# Altium project XMC4800-Dev.PrjPcb
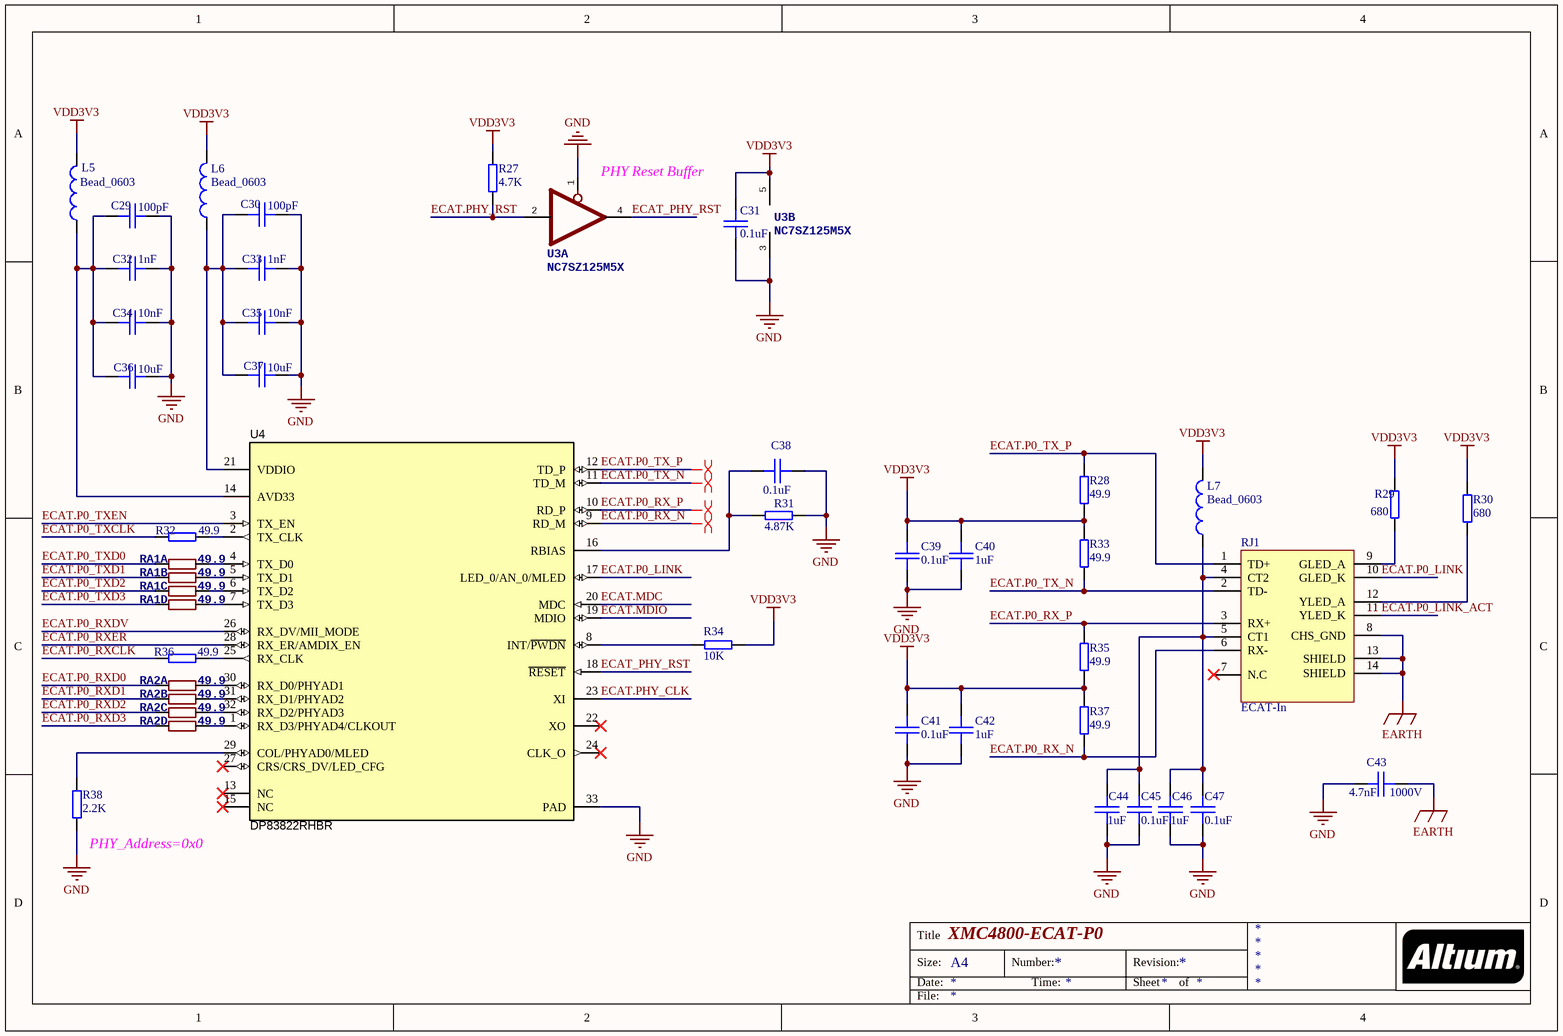
[diagram p0: XMC4800-ECAT-P0.SchDoc]
5 sheets, 160 parts. Net scope: global (net labels, ports and power ports of the same name join across sheets).
Board file: XMC4800-Dev.PcbDoc
Sheets:
  XMC4800-ECAT-P0.SchDoc
  XMC4800-ECAT-P1.SchDoc
  XMC4800-Core.SchDoc
  XMC4800-Power.SchDoc
  XMC4800-Misc.SchDoc

## Sheet XMC4800-ECAT-P0.SchDoc: XMC4800-ECAT-P0
size A4

### Parts
C29  100pF  [CAP-0603]
C30  100pF  [CAP-0603]
C31  0.1uF  [CAP-0603]
C32  1nF  [CAP-0603]
C33  1nF  [CAP-0603]
C34  10nF  [CAP-0603]
C35  10nF  [CAP-0603]
C36  10uF  [CAP-0603]
C37  10uF  [CAP-0603]
C38  0.1uF  [CAP-0603]
C39  0.1uF  [CAP-0603]
C40  1uF  [CAP-0603]
C41  0.1uF  [CAP-0603]
C42  1uF  [CAP-0603]
C43  4.7nF  voltage: 1000V  [CAP-1206]
C44  1uF  [CAP-0603]
C45  0.1uF  [CAP-0603]
C46  1uF  [CAP-0603]
C47  0.1uF  [CAP-0603]
L5  Bead_0603  [L-0603]
L6  Bead_0603  [L-0603]
L7  Bead_0603  [L-0603]
R27  4.7K  [RES-0603]
R28  49.9  [RES-0603]
R29  680  [RES-0603]
R30  680  [RES-0603]
R31  4.87K  [RES-0603]
R32  49.9  [RES-0603]
R33  49.9  [RES-0603]
R34  10K  [RES-0603]
R35  49.9  [RES-0603]
R36  49.9  [RES-0603]
R37  49.9  [RES-0603]
R38  2.2K  [RES-0603]
RA1  49.9  [LC-0603_Rx4]  (parts A,B,C,D of 4)
RA2  49.9  [LC-0603_Rx4]  (parts A,B,C,D of 4)
RJ1  ECAT-In  [HR911105A]
U3  NC7SZ125M5X  [LC-SOT-23-5]  (parts A,B of 2)
U4  DP83822RHBR  [RHB0032B]

### Nets
EARTH: C43.2 RJ1.8(CHS_GND) RJ1.13(SHIELD) RJ1.14(SHIELD)
GND: C29.2 C30.2 C31.2 C32.1 C33.1 C34.1 C35.1 C36.1 C37.1 C38.2 C39.2 C40.2 C41.2 C42.2 C43.1 C44.2 C45.2 C46.2 C47.2 R31.2 R38.1 U3.1(OE) U3.3(GND) U4.33(PAD)
VDD3V3: C31.1 C39.1 C40.1 C41.1 C42.1 L5.2 L6.2 L7.2 R27.2 R28.1 R29.2 R30.1 R33.2 R34.2 R35.1 R37.2 U3.5(VDD)
ECAT.MDC: U4.20(MDC)
ECAT.MDIO: U4.19(MDIO)
ECAT.P0_LINK: RJ1.10(GLED_K) U4.17(LED_0/AN_0/MLED)
ECAT.P0_LINK_ACT: RJ1.11(YLED_K)
ECAT.P0_RX_N: R37.1 RJ1.6(RX-) U4.9(RD_M)
ECAT.P0_RX_P: R35.2 RJ1.3(RX+) U4.10(RD_P)
ECAT.P0_RXCLK: R36.1
ECAT.P0_RXD0: RA2.1
ECAT.P0_RXD1: RA2.2
ECAT.P0_RXD2: RA2.3
ECAT.P0_RXD3: RA2.4
ECAT.P0_RXDV: U4.26(RX_DV/MII_MODE)
ECAT.P0_RXER: U4.28(RX_ER/AMDIX_EN)
ECAT.P0_TX_N: R33.1 RJ1.2(TD-) U4.11(TD_M)
ECAT.P0_TX_P: R28.2 RJ1.1(TD+) U4.12(TD_P)
ECAT.P0_TXCLK: R32.1
ECAT.P0_TXD0: RA1.1
ECAT.P0_TXD1: RA1.2
ECAT.P0_TXD2: RA1.3
ECAT.P0_TXD3: RA1.4
ECAT.P0_TXEN: U4.3(TX_EN)
ECAT.PHY_CLK: U4.23(XI)
ECAT.PHY_RST: R27.1 U3.2(I)
ECAT_PHY_RST: U3.4(O) U4.18(~{RESET})
NetC29_1: C29.1 C32.2 C34.2 C36.2 L5.1 U4.14(AVD33)
NetC30_1: C30.1 C33.2 C35.2 C37.2 L6.1 U4.21(VDDIO)
NetC38_1: C38.1 R31.1 U4.16(RBIAS)
NetC44_1: C44.1 C45.1 C46.1 C47.1 L7.1 RJ1.4(CT2) RJ1.5(CT1)
NetR29_1: R29.1 RJ1.9(GLED_A)
NetR30_2: R30.2 RJ1.12(YLED_A)
NetR32_2: R32.2 U4.2(TX_CLK)
NetR34_1: R34.1 U4.8(INT/~{PWDN})
NetR36_2: R36.2 U4.25(RX_CLK)
NetR38_2: R38.2 U4.29(COL/PHYAD0/MLED)
NetRA1_5: RA1.5 U4.7(TX_D3)
NetRA1_6: RA1.6 U4.6(TX_D2)
NetRA1_7: RA1.7 U4.5(TX_D1)
NetRA1_8: RA1.8 U4.4(TX_D0)
NetRA2_5: RA2.5 U4.1(RX_D3/PHYAD4/CLKOUT)
NetRA2_6: RA2.6 U4.32(RX_D2/PHYAD3)
NetRA2_7: RA2.7 U4.31(RX_D1/PHYAD2)
NetRA2_8: RA2.8 U4.30(RX_D0/PHYAD1)

Not connected (* = marked no-connect by the designer): RJ1 7(N.C)*; U4 13(NC)* 15(NC)* 22(XO)* 24(CLK_O)* 27(CRS/CRS_DV/LED_CFG)*

### Layout directives
differential pair: ECAT.P0_RX_N, ECAT.P0_RX_P, ECAT.P0_TX_N, ECAT.P0_TX_P

### Notes on the sheet
- (near U3) PHY Reset Buffer
- (near R38) PHY_Address=0x0
- Title
- Size:
- Date:
- A4
- Number:
- Time:
- Revision:
- Sheet
- of
- File:

### Library data of the parts
C29-C42 C44-C47 = C_0603: 陶瓷贴片电容0603; tolerance: 10%; voltage: 50V; ESR: 1.73mOhm; IRMS: 5.59A; Series: X7R
  C29 C30: C_value: 100pF
  C31 C38 C39 C41 C45 C47: C_value: 0.1uF
  C32 C33: C_value: 1nF
  C34 C35: C_value: 10nF
  C36 C37: C_value: 10uF
  C40 C42 C44 C46: C_value: 1uF
C43 = C_1206: 陶瓷贴片电容1206; tolerance: 10%; C_value: 4.7nF
L5-L7 = Bead_0603: 贴片磁珠0603; Impedance: 120Ohm; Current: 2A
R27-R38 = R_0603: 贴片电阻0603; tolerance: 5%; voltage: 50V; power: 0.063W
  R27: R_value: 4.7K
  R28 R32 R33 R35-R37: R_value: 49.9
  R29 R30: R_value: 680
  R31: R_value: 4.87K
  R34: R_value: 10K
  R38: R_value: 2.2K
RA1 RA2 = RS_ARR4: 排阻; R_Value: 49.9
RJ1 = HR911105A: Input; LatestRevisionDate: 17-Jul-2002; LatestRevisionNote: Re-released for DXP Platform.; Publisher: Altium Limited
U3 = NC7SZ125M5X: 单通道缓冲器，3态输出
U4 = DP83822RHBR: 10/100 Ethernet PHY, RHB0032B; Alternate PartNumber: DP83822RHBT; Manufacturer: Texas Instruments; SymbolCreator: Altium; SizeArea_mm2: 25; SizeAreaWB_mm2: 49; SizeX_mm: 5; SizeZ_mm: 1; CompType: IC; U/M: EA; SymbolVersion: 2016-3-6; PartNumber: DP83822RHBR; PackageReference: RHB0032B; PackageDescription: VQFN-32; MountType: SMT; SizeY_mm: 5; ComponentLink1Description: Datasheet Link; ComponentLink1URL: https://sps06.itg.ti.com/sites/KMS/crossdivteams/altium/docs/ComponentDatasheets/DP83822 Hardware Requirements.docx; RoHS: Y; Publisher: Texas Instruments; LatestRevisionDate: 2016-07-20; Alternate Manufacturer: Texas Instruments

## Sheet XMC4800-ECAT-P1.SchDoc: XMC4800-ECAT-P1
size A4
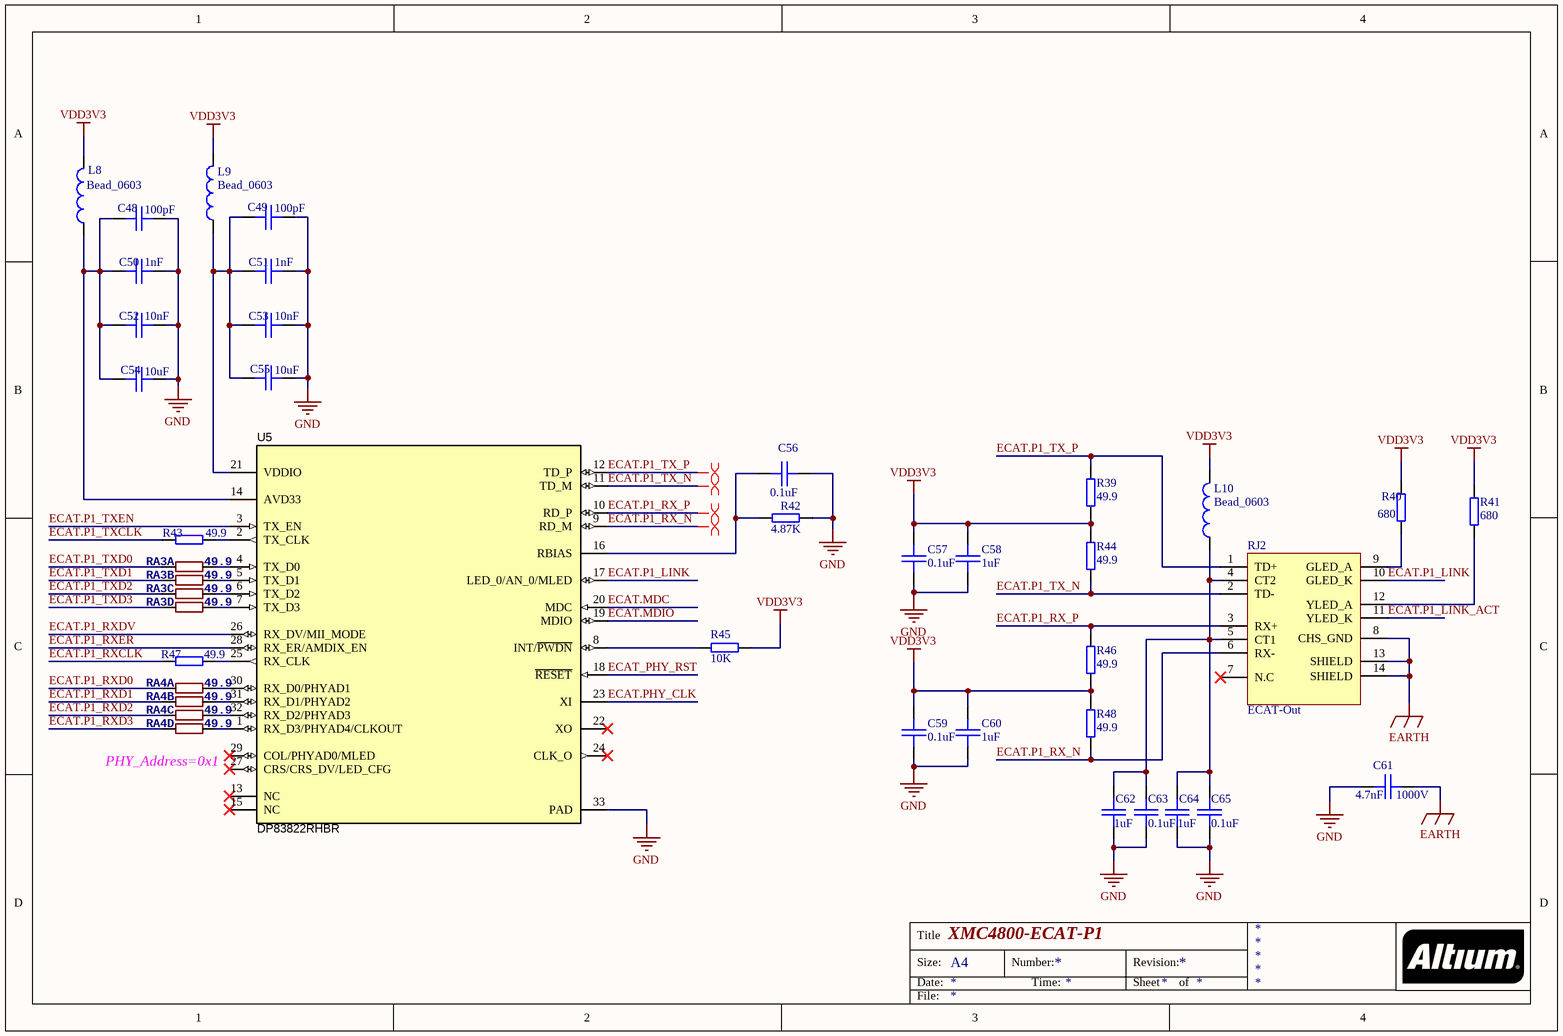
[diagram p1: XMC4800-ECAT-P1.SchDoc]

### Parts
C48  100pF  [CAP-0603]
C49  100pF  [CAP-0603]
C50  1nF  [CAP-0603]
C51  1nF  [CAP-0603]
C52  10nF  [CAP-0603]
C53  10nF  [CAP-0603]
C54  10uF  [CAP-0603]
C55  10uF  [CAP-0603]
C56  0.1uF  [CAP-0603]
C57  0.1uF  [CAP-0603]
C58  1uF  [CAP-0603]
C59  0.1uF  [CAP-0603]
C60  1uF  [CAP-0603]
C61  4.7nF  voltage: 1000V  [CAP-1206]
C62  1uF  [CAP-0603]
C63  0.1uF  [CAP-0603]
C64  1uF  [CAP-0603]
C65  0.1uF  [CAP-0603]
L8  Bead_0603  [L-0603]
L9  Bead_0603  [L-0603]
L10  Bead_0603  [L-0603]
R39  49.9  [RES-0603]
R40  680  [RES-0603]
R41  680  [RES-0603]
R42  4.87K  [RES-0603]
R43  49.9  [RES-0603]
R44  49.9  [RES-0603]
R45  10K  [RES-0603]
R46  49.9  [RES-0603]
R47  49.9  [RES-0603]
R48  49.9  [RES-0603]
RA3  49.9  [LC-0603_Rx4]  (parts A,B,C,D of 4)
RA4  49.9  [LC-0603_Rx4]  (parts A,B,C,D of 4)
RJ2  ECAT-Out  [HR911105A]
U5  DP83822RHBR  [RHB0032B]

### Nets
EARTH: C61.2 RJ2.8(CHS_GND) RJ2.13(SHIELD) RJ2.14(SHIELD)
GND: C48.2 C49.2 C50.1 C51.1 C52.1 C53.1 C54.1 C55.1 C56.2 C57.2 C58.2 C59.2 C60.2 C61.1 C62.2 C63.2 C64.2 C65.2 R42.2 U5.33(PAD)
VDD3V3: C57.1 C58.1 C59.1 C60.1 L8.2 L9.2 L10.2 R39.1 R40.2 R41.1 R44.2 R45.2 R46.1 R48.2
ECAT.MDC: U5.20(MDC)
ECAT.MDIO: U5.19(MDIO)
ECAT.P1_LINK: RJ2.10(GLED_K) U5.17(LED_0/AN_0/MLED)
ECAT.P1_LINK_ACT: RJ2.11(YLED_K)
ECAT.P1_RX_N: R48.1 RJ2.6(RX-) U5.9(RD_M)
ECAT.P1_RX_P: R46.2 RJ2.3(RX+) U5.10(RD_P)
ECAT.P1_RXCLK: R47.1
ECAT.P1_RXD0: RA4.1
ECAT.P1_RXD1: RA4.2
ECAT.P1_RXD2: RA4.3
ECAT.P1_RXD3: RA4.4
ECAT.P1_RXDV: U5.26(RX_DV/MII_MODE)
ECAT.P1_RXER: U5.28(RX_ER/AMDIX_EN)
ECAT.P1_TX_N: R44.1 RJ2.2(TD-) U5.11(TD_M)
ECAT.P1_TX_P: R39.2 RJ2.1(TD+) U5.12(TD_P)
ECAT.P1_TXCLK: R43.1
ECAT.P1_TXD0: RA3.1
ECAT.P1_TXD1: RA3.2
ECAT.P1_TXD2: RA3.3
ECAT.P1_TXD3: RA3.4
ECAT.P1_TXEN: U5.3(TX_EN)
ECAT.PHY_CLK: U5.23(XI)
ECAT_PHY_RST: U5.18(~{RESET})
NetC48_1: C48.1 C50.2 C52.2 C54.2 L8.1 U5.14(AVD33)
NetC49_1: C49.1 C51.2 C53.2 C55.2 L9.1 U5.21(VDDIO)
NetC56_1: C56.1 R42.1 U5.16(RBIAS)
NetC62_1: C62.1 C63.1 C64.1 C65.1 L10.1 RJ2.4(CT2) RJ2.5(CT1)
NetR40_1: R40.1 RJ2.9(GLED_A)
NetR41_2: R41.2 RJ2.12(YLED_A)
NetR43_2: R43.2 U5.2(TX_CLK)
NetR45_1: R45.1 U5.8(INT/~{PWDN})
NetR47_2: R47.2 U5.25(RX_CLK)
NetRA3_5: RA3.5 U5.7(TX_D3)
NetRA3_6: RA3.6 U5.6(TX_D2)
NetRA3_7: RA3.7 U5.5(TX_D1)
NetRA3_8: RA3.8 U5.4(TX_D0)
NetRA4_5: RA4.5 U5.1(RX_D3/PHYAD4/CLKOUT)
NetRA4_6: RA4.6 U5.32(RX_D2/PHYAD3)
NetRA4_7: RA4.7 U5.31(RX_D1/PHYAD2)
NetRA4_8: RA4.8 U5.30(RX_D0/PHYAD1)

Not connected (* = marked no-connect by the designer): RJ2 7(N.C)*; U5 13(NC)* 15(NC)* 22(XO)* 24(CLK_O)* 27(CRS/CRS_DV/LED_CFG)* 29(COL/PHYAD0/MLED)*

### Layout directives
differential pair: ECAT.P1_RX_N, ECAT.P1_RX_P, ECAT.P1_TX_N, ECAT.P1_TX_P

### Notes on the sheet
- (near RA4) PHY_Address=0x1
- Title
- Size:
- Date:
- A4
- Number:
- Time:
- Revision:
- Sheet
- of
- File:

### Library data of the parts
C48-C60 C62-C65 = C_0603: as C29 on sheet XMC4800-ECAT-P0; Series: X7R
  C48 C49: C_value: 100pF
  C50 C51: C_value: 1nF
  C52 C53: C_value: 10nF
  C54 C55: C_value: 10uF
  C56 C57 C59 C63 C65: C_value: 0.1uF
  C58 C60 C62 C64: C_value: 1uF
C61 = C_1206: 陶瓷贴片电容1206; tolerance: 10%; C_value: 4.7nF
L8-L10 = Bead_0603: 贴片磁珠0603; Impedance: 120Ohm; Current: 2A
R39-R48 = R_0603: as R27 on sheet XMC4800-ECAT-P0
  R39 R43 R44 R46-R48: R_value: 49.9
  R40 R41: R_value: 680
  R42: R_value: 4.87K
  R45: R_value: 10K
RA3 RA4 = RS_ARR4: 排阻; R_Value: 49.9
RJ2 = HR911105A: Output; LatestRevisionDate: 17-Jul-2002; LatestRevisionNote: Re-released for DXP Platform.; Publisher: Altium Limited
U5 = DP83822RHBR: as U4 on sheet XMC4800-ECAT-P0; SymbolVersion: 2016-3-6; PartNumber: DP83822RHBR; PackageReference: RHB0032B; PackageDescription: VQFN-32; MountType: SMT; SizeY_mm: 5; ComponentLink1Description: Datasheet Link; ComponentLink1URL: https://sps06.itg.ti.com/sites/KMS/crossdivteams/altium/docs/ComponentDatasheets/DP83822 Hardware Requirements.docx; RoHS: Y; Publisher: Texas Instruments; LatestRevisionDate: 2016-07-20; Alternate Manufacturer: Texas Instruments

## Sheet XMC4800-Core.SchDoc: XMC4800-Core
size A4
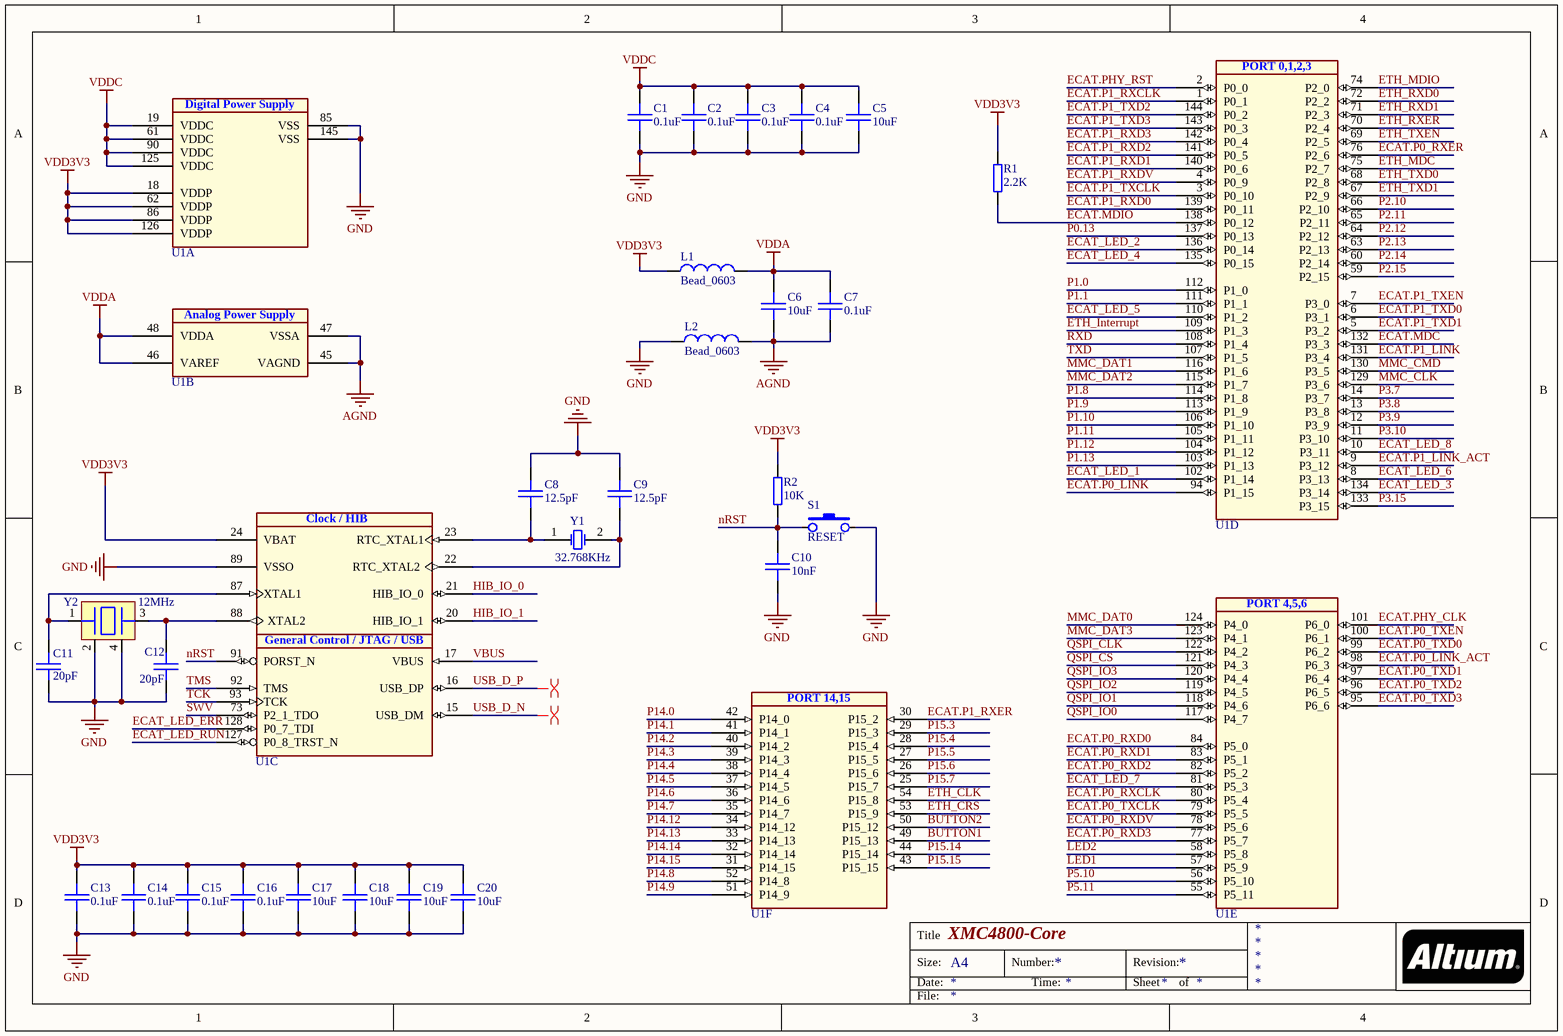
[diagram p2: XMC4800-Core.SchDoc]

### Parts
C1  0.1uF  [CAP-0603]
C2  0.1uF  [CAP-0603]
C3  0.1uF  [CAP-0603]
C4  0.1uF  [CAP-0603]
C5  10uF  [CAP-0603]
C6  10uF  [CAP-0603]
C7  0.1uF  [CAP-0603]
C8  12.5pF  [CAP-0603]
C9  12.5pF  [CAP-0603]
C10  10nF  [CAP-0603]
C11  20pF  [CAP-0603]
C12  20pF  [CAP-0603]
C13  0.1uF  [CAP-0603]
C14  0.1uF  [CAP-0603]
C15  0.1uF  [CAP-0603]
C16  0.1uF  [CAP-0603]
C17  10uF  [CAP-0603]
C18  10uF  [CAP-0603]
C19  10uF  [CAP-0603]
C20  10uF  [CAP-0603]
L1  Bead_0603  [L-0603]
L2  Bead_0603  [L-0603]
R1  2.2K  [RES-0603]
R2  10K  [RES-0603]
S1  RESET  [KEY_3X4X2]
U1  XMC4800-F144F1024  [QFP50P2200X2200X160-145N-2]  (value not drawn)  (parts A,B,C,D,E,F of 6)
Y1  32.768KHz  [FC-135(3215)]
Y2  12MHz  [LC-SMD-3225_4P]

### Nets
AGND: C6.2 C7.2 L2.2 U1.45(VAGND) U1.47(VSSA)
GND: C1.2 C2.2 C3.2 C4.2 C5.2 C8.1 C9.1 C10.2 C11.2 C12.2 C13.2 C14.2 C15.2 C16.2 C17.2 C18.2 C19.2 C20.2 L2.1 S1.2 U1.85(VSS) U1.89(VSSO) U1.145(VSS) Y2.2 Y2.4
VDD3V3: C13.1 C14.1 C15.1 C16.1 C17.1 C18.1 C19.1 C20.1 L1.1 R1.2 R2.2 U1.18(VDDP) U1.24(VBAT) U1.62(VDDP) U1.86(VDDP) U1.126(VDDP)
VDDA: C6.1 C7.1 L1.2 U1.46(VAREF) U1.48(VDDA)
VDDC: C1.1 C2.1 C3.1 C4.1 C5.1 U1.19(VDDC) U1.61(VDDC) U1.90(VDDC) U1.125(VDDC)
BUTTON1: U1.49(P15_13)
BUTTON2: U1.50(P15_12)
ECAT.MDC: U1.132(P3_3)
ECAT.MDIO: R1.1 U1.138(P0_12)
ECAT.P0_LINK: U1.94(P1_15)
ECAT.P0_LINK_ACT: U1.98(P6_3)
ECAT.P0_RXCLK: U1.80(P5_4)
ECAT.P0_RXD0: U1.84(P5_0)
ECAT.P0_RXD1: U1.83(P5_1)
ECAT.P0_RXD2: U1.82(P5_2)
ECAT.P0_RXD3: U1.77(P5_7)
ECAT.P0_RXDV: U1.78(P5_6)
ECAT.P0_RXER: U1.76(P2_6)
ECAT.P0_TXCLK: U1.79(P5_5)
ECAT.P0_TXD0: U1.99(P6_2)
ECAT.P0_TXD1: U1.97(P6_4)
ECAT.P0_TXD2: U1.96(P6_5)
ECAT.P0_TXD3: U1.95(P6_6)
ECAT.P0_TXEN: U1.100(P6_1)
ECAT.P1_LINK: U1.131(P3_4)
ECAT.P1_LINK_ACT: U1.9(P3_12)
ECAT.P1_RXCLK: U1.1(P0_1)
ECAT.P1_RXD0: U1.139(P0_11)
ECAT.P1_RXD1: U1.140(P0_6)
ECAT.P1_RXD2: U1.141(P0_5)
ECAT.P1_RXD3: U1.142(P0_4)
ECAT.P1_RXDV: U1.4(P0_9)
ECAT.P1_RXER: U1.30(P15_2)
ECAT.P1_TXCLK: U1.3(P0_10)
ECAT.P1_TXD0: U1.6(P3_1)
ECAT.P1_TXD1: U1.5(P3_2)
ECAT.P1_TXD2: U1.144(P0_2)
ECAT.P1_TXD3: U1.143(P0_3)
ECAT.P1_TXEN: U1.7(P3_0)
ECAT.PHY_CLK: U1.101(P6_0)
ECAT.PHY_RST: U1.2(P0_0)
ECAT_LED_1: U1.102(P1_14)
ECAT_LED_2: U1.136(P0_14)
ECAT_LED_3: U1.134(P3_14)
ECAT_LED_4: U1.135(P0_15)
ECAT_LED_5: U1.110(P1_2)
ECAT_LED_6: U1.8(P3_13)
ECAT_LED_7: U1.81(P5_3)
ECAT_LED_8: U1.10(P3_11)
ECAT_LED_ERR: U1.128(P0_7_TDI)
ECAT_LED_RUN: U1.127(P0_8_TRST_N)
ETH_CLK: U1.54(P15_8)
ETH_CRS: U1.53(P15_9)
ETH_Interrupt: U1.109(P1_3)
ETH_MDC: U1.75(P2_7)
ETH_MDIO: U1.74(P2_0)
ETH_RXD0: U1.72(P2_2)
ETH_RXD1: U1.71(P2_3)
ETH_RXER: U1.70(P2_4)
ETH_TXD0: U1.68(P2_8)
ETH_TXD1: U1.67(P2_9)
ETH_TXEN: U1.69(P2_5)
HIB_IO_0: U1.21(HIB_IO_0)
HIB_IO_1: U1.20(HIB_IO_1)
LED1: U1.57(P5_9)
LED2: U1.58(P5_8)
MMC_CLK: U1.129(P3_6)
MMC_CMD: U1.130(P3_5)
MMC_DAT0: U1.124(P4_0)
MMC_DAT1: U1.116(P1_6)
MMC_DAT2: U1.115(P1_7)
MMC_DAT3: U1.123(P4_1)
nRST: C10.1 R2.1 S1.1 U1.91(PORST_N)
P0.13: U1.137(P0_13)
P1.0: U1.112(P1_0)
P1.1: U1.111(P1_1)
P1.8: U1.114(P1_8)
P1.9: U1.113(P1_9)
P1.10: U1.106(P1_10)
P1.11: U1.105(P1_11)
P1.12: U1.104(P1_12)
P1.13: U1.103(P1_13)
P2.10: U1.66(P2_10)
P2.11: U1.65(P2_11)
P2.12: U1.64(P2_12)
P2.13: U1.63(P2_13)
P2.14: U1.60(P2_14)
P2.15: U1.59(P2_15)
P3.7: U1.14(P3_7)
P3.8: U1.13(P3_8)
P3.9: U1.12(P3_9)
P3.10: U1.11(P3_10)
P3.15: U1.133(P3_15)
P5.10: U1.56(P5_10)
P5.11: U1.55(P5_11)
P14.0: U1.42(P14_0)
P14.1: U1.41(P14_1)
P14.2: U1.40(P14_2)
P14.3: U1.39(P14_3)
P14.4: U1.38(P14_4)
P14.5: U1.37(P14_5)
P14.6: U1.36(P14_6)
P14.7: U1.35(P14_7)
P14.8: U1.52(P14_8)
P14.9: U1.51(P14_9)
P14.12: U1.34(P14_12)
P14.13: U1.33(P14_13)
P14.14: U1.32(P14_14)
P14.15: U1.31(P14_15)
P15.3: U1.29(P15_3)
P15.4: U1.28(P15_4)
P15.5: U1.27(P15_5)
P15.6: U1.26(P15_6)
P15.7: U1.25(P15_7)
P15.14: U1.44(P15_14)
P15.15: U1.43(P15_15)
QSPI_CLK: U1.122(P4_2)
QSPI_CS: U1.121(P4_3)
QSPI_IO0: U1.117(P4_7)
QSPI_IO1: U1.118(P4_6)
QSPI_IO2: U1.119(P4_5)
QSPI_IO3: U1.120(P4_4)
RXD: U1.108(P1_4)
SWV: U1.73(P2_1_TDO)
TCK: U1.93(TCK)
TMS: U1.92(TMS)
TXD: U1.107(P1_5)
USB_D_N: U1.15(USB_DM)
USB_D_P: U1.16(USB_DP)
VBUS: U1.17(VBUS)
NetC8_2: C8.2 U1.23(RTC_XTAL1) Y1.1(OSC1)
NetC9_2: C9.2 U1.22(RTC_XTAL2) Y1.2(OSC2)
NetC11_1: C11.1 U1.87(XTAL1) Y2.1
NetC12_1: C12.1 U1.88(XTAL2) Y2.3

### Layout directives
differential pair: USB_D_N, USB_D_P

### Notes on the sheet
- Title
- Size:
- Date:
- A4
- Number:
- Time:
- Revision:
- Sheet
- of
- File:
- (in symbol XMC4800-F144F1024, part A) Digital Power Supply
- (in symbol XMC4800-F144F1024, part B) Analog Power Supply
- (in symbol XMC4800-F144F1024, part C) Clock / HIB; General Control / JTAG / USB
- (in symbol XMC4800-F144F1024, part D) PORT 0,1,2,3
- (in symbol XMC4800-F144F1024, part E) PORT 4,5,6
- (in symbol XMC4800-F144F1024, part F) PORT 14,15

### Library data of the parts
C1-C20 = C_0603: as C29 on sheet XMC4800-ECAT-P0; Series: X7R
  C1-C4 C7 C13-C16: C_value: 0.1uF
  C5 C6 C17-C20: C_value: 10uF
  C8 C9: C_value: 12.5pF
  C10: C_value: 10nF
  C11 C12: C_value: 20pF
L1 L2 = Bead_0603: 贴片磁珠0603; Impedance: 120Ohm; Current: 2A
R1 R2 = R_0603: as R27 on sheet XMC4800-ECAT-P0
  R1: R_value: 2.2K
  R2: R_value: 10K
S1 = KEY: 轻触开关3X4X2
U1 = XMC4800-F144F1024: XMC4000 Family Microcontroller for Industrial Applications, ARM® Cortex™-M4, 32-bit processor core,Flash 1024 Kbytes,SRAM 352 Kbytes (Temperature Range -40°C to 85°C); Manufacturer: Infineon Technologies; ManufacturerPartNumber: XMC4800-F144F1024; PackageReference: PG-LQFP-144
Y1 = OSC_32768: 32.768KHz时钟晶振; X_value: 32.768KHz
Y2 = XTAL_PASSIVE: 贴片无源晶振(3225); X_value: 12MHz

## Sheet XMC4800-Power.SchDoc: XMC4800-Power
size A4
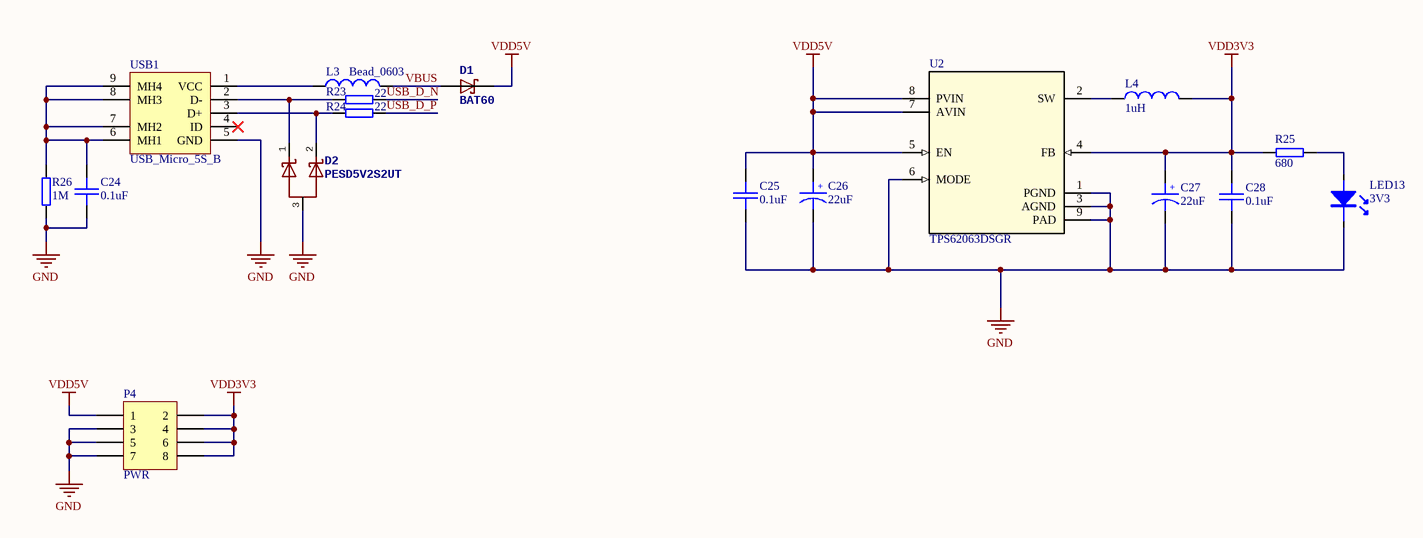
[diagram p3: XMC4800-Power.SchDoc]

### Parts
C24  0.1uF  [CAP-0603]
C25  0.1uF  [CAP-0603]
C26  22uF  [C_Tantalum_B]
C27  22uF  [C_Tantalum_B]
C28  0.1uF  [CAP-0603]
D1  BAT60  [LC-SOD-323]
D2  PESD5V2S2UT  [LC-SOT-23-3]
L3  Bead_0603  [L-0603]
L4  1uH  [L-PWR-06030]
LED13  3V3  [LED_0603]
P4  PWR  [HDR2X4]
R23  22  [RES-0603]
R24  22  [RES-0603]
R25  680  [RES-0603]
R26  1M  [RES-0603]
U2  TPS62063DSGR  [DSG0008A]
USB1  USB_Micro_5S_B  [USB_MICRO_5S_B]

### Nets
GND: C24.2 C25.2 C26.2 C27.2 C28.2 D2.3 LED13.2(K) P4.3 P4.5 P4.7 R26.1 U2.1(PGND) U2.3(AGND) U2.6(MODE) U2.9(PAD) USB1.5(GND)
VDD3V3: C27.1 C28.1 L4.2 P4.2 P4.4 P4.6 P4.8 R25.1 U2.4(FB)
VDD5V: C25.1 C26.1 D1.2(C) P4.1 U2.5(EN) U2.7(AVIN) U2.8(PVIN)
USB_D_N: R23.2
USB_D_P: R24.2
VBUS: D1.1(A) L3.2
NetC24_1: C24.1 R26.2 USB1.6(MH1) USB1.7(MH2) USB1.8(MH3) USB1.9(MH4)
NetD2_1: D2.1 R23.1 USB1.2(D-)
NetD2_2: D2.2 R24.1 USB1.3(D+)
NetL3_1: L3.1 USB1.1(VCC)
NetL4_1: L4.1 U2.2(SW)
NetLED13_1: LED13.1(A) R25.2

Not connected (* = marked no-connect by the designer): USB1 4(ID)*

### Notes on the sheet
- Title
- Size:
- Date:
- A4
- Number:
- Time:
- Revision:
- Sheet
- of
- File:
- (in symbol C_Tantalum_B) +

### Library data of the parts
C24 C25 C28 = C_0603: as C29 on sheet XMC4800-ECAT-P0; C_value: 0.1uF; Series: X7R
C26 C27 = C_Tantalum_B: 贴片钽电容B型; voltage: 16V; C_value: 22uF
D1 = BAT60: 肖特基二极管
L3 = Bead_0603: 贴片磁珠0603; Impedance: 120Ohm; Current: 2A
L4 = L_Power: 功率电感; DCR: 0.1Ohm; IDC: 2.7A; tolerance: 20%; L_value: 1uH
LED13 = LED_0603: 0603封装发光二极管
P4 = Header 4X2: Header, 4-Pin, Dual row; LatestRevisionDate: 17-Jul-2002; LatestRevisionNote: Re-released for DXP Platform.; Publisher: Altium Limited
R23-R26 = R_0603: as R27 on sheet XMC4800-ECAT-P0
  R23 R24: R_value: 22
  R25: R_value: 680
  R26: R_value: 1M
U2 = TPS62063DSGR: Manufacturer: Texas Instruments; CompType: IC; PIN_COUNT: 9; PartNumber: TPS62063DSG; PackageReference: DSG0008A; MountType: SMT; RoHS: Y; Manufacturer_Part_Number: TPS62063DSGR; Manufacturer_Name: Texas Instruments; Value: Value; Type: Type; Refdes: Refdes
USB1 = USB_Micro_5S_B: micro USB母座5SB型

## Sheet XMC4800-Misc.SchDoc: XMC4800-Misc
size A4
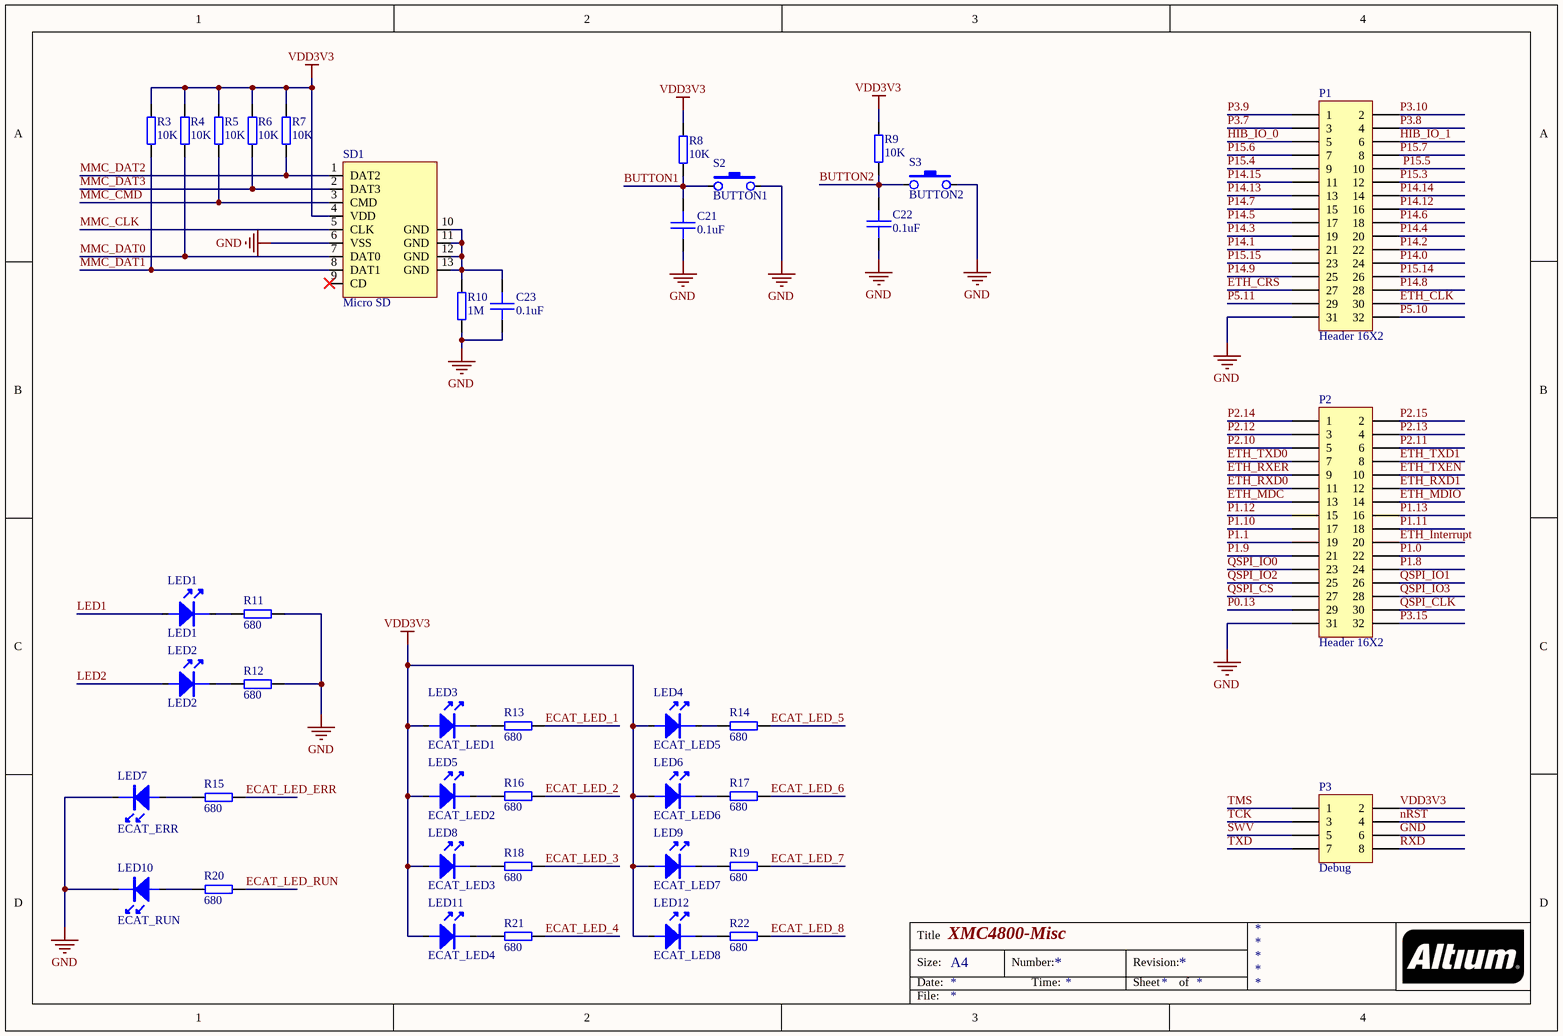
[diagram p4: XMC4800-Misc.SchDoc]

### Parts
C21  0.1uF  [CAP-0603]
C22  0.1uF  [CAP-0603]
C23  0.1uF  [CAP-0603]
LED1  LED1  [LED_0603]
LED2  LED2  [LED_0603]
LED3  ECAT_LED1  [LED_0603]
LED4  ECAT_LED5  [LED_0603]
LED5  ECAT_LED2  [LED_0603]
LED6  ECAT_LED6  [LED_0603]
LED7  ECAT_ERR  [P-LCC-2]
LED8  ECAT_LED3  [LED_0603]
LED9  ECAT_LED7  [LED_0603]
LED10  ECAT_RUN  [P-LCC-2]
LED11  ECAT_LED4  [LED_0603]
LED12  ECAT_LED8  [LED_0603]
P1  Header 16X2  [HDR2X16]
P2  Header 16X2  [HDR2X16]
P3  Debug  [HDR2X4]
R3  10K  [RES-0603]
R4  10K  [RES-0603]
R5  10K  [RES-0603]
R6  10K  [RES-0603]
R7  10K  [RES-0603]
R8  10K  [RES-0603]
R9  10K  [RES-0603]
R10  1M  [RES-0603]
R11  680  [RES-0603]
R12  680  [RES-0603]
R13  680  [RES-0603]
R14  680  [RES-0603]
R15  680  [RES-0603]
R16  680  [RES-0603]
R17  680  [RES-0603]
R18  680  [RES-0603]
R19  680  [RES-0603]
R20  680  [RES-0603]
R21  680  [RES-0603]
R22  680  [RES-0603]
S2  BUTTON1  [KEY_3X4X2]
S3  BUTTON2  [KEY_3X4X2]
SD1  Micro SD  [7MSDP-B0-1012]

### Nets
GND: C21.2 C22.2 C23.2 LED7.C(K) LED10.C(K) P1.31 P2.31 P3.6 R10.1 R11.2 R12.2 S2.2 S3.2 SD1.6(VSS)
VDD3V3: LED3.1(A) LED4.1(A) LED5.1(A) LED6.1(A) LED8.1(A) LED9.1(A) LED11.1(A) LED12.1(A) P3.2 R3.2 R4.2 R5.2 R6.2 R7.2 R8.2 R9.2 SD1.4(VDD)
BUTTON1: C21.1 R8.1 S2.1
BUTTON2: C22.1 R9.1 S3.1
ECAT_LED_1: R13.2
ECAT_LED_2: R16.2
ECAT_LED_3: R18.2
ECAT_LED_4: R21.2
ECAT_LED_5: R14.2
ECAT_LED_6: R17.2
ECAT_LED_7: R19.2
ECAT_LED_8: R22.2
ECAT_LED_ERR: R15.2
ECAT_LED_RUN: R20.2
ETH_CLK: P1.30
ETH_CRS: P1.27
ETH_Interrupt: P2.20
ETH_MDC: P2.13
ETH_MDIO: P2.14
ETH_RXD0: P2.11
ETH_RXD1: P2.12
ETH_RXER: P2.9
ETH_TXD0: P2.7
ETH_TXD1: P2.8
ETH_TXEN: P2.10
HIB_IO_0: P1.5
HIB_IO_1: P1.6
LED1: LED1.1(A)
LED2: LED2.1(A)
MMC_CLK: SD1.5(CLK)
MMC_CMD: R5.1 SD1.3(CMD)
MMC_DAT0: R4.1 SD1.7(DAT0)
MMC_DAT1: R3.1 SD1.8(DAT1)
MMC_DAT2: R7.1 SD1.1(DAT2)
MMC_DAT3: R6.1 SD1.2(DAT3)
nRST: P3.4
P0.13: P2.29
P1.0: P2.22
P1.1: P2.19
P1.8: P2.24
P1.9: P2.21
P1.10: P2.17
P1.11: P2.18
P1.12: P2.15
P1.13: P2.16
P2.10: P2.5
P2.11: P2.6
P2.12: P2.3
P2.13: P2.4
P2.14: P2.1
P2.15: P2.2
P3.7: P1.3
P3.8: P1.4
P3.9: P1.1
P3.10: P1.2
P3.15: P2.32
P5.10: P1.32
P5.11: P1.29
P14.0: P1.24
P14.1: P1.21
P14.2: P1.22
P14.3: P1.19
P14.4: P1.20
P14.5: P1.17
P14.6: P1.18
P14.7: P1.15
P14.8: P1.28
P14.9: P1.25
P14.12: P1.16
P14.13: P1.13
P14.14: P1.14
P14.15: P1.11
P15.3: P1.12
P15.4: P1.9
P15.5: P1.10
P15.6: P1.7
P15.7: P1.8
P15.14: P1.26
P15.15: P1.23
QSPI_CLK: P2.30
QSPI_CS: P2.27
QSPI_IO0: P2.23
QSPI_IO1: P2.26
QSPI_IO2: P2.25
QSPI_IO3: P2.28
RXD: P3.8
SWV: P3.5
TCK: P3.3
TMS: P3.1
TXD: P3.7
NetC23_1: C23.1 R10.2 SD1.10(GND) SD1.11(GND) SD1.12(GND) SD1.13(GND)
NetLED1_2: LED1.2(K) R11.1
NetLED2_2: LED2.2(K) R12.1
NetLED3_2: LED3.2(K) R13.1
NetLED4_2: LED4.2(K) R14.1
NetLED5_2: LED5.2(K) R16.1
NetLED6_2: LED6.2(K) R17.1
NetLED7_A: LED7.A R15.1
NetLED8_2: LED8.2(K) R18.1
NetLED9_2: LED9.2(K) R19.1
NetLED10_A: LED10.A R20.1
NetLED11_2: LED11.2(K) R21.1
NetLED12_2: LED12.2(K) R22.1

Not connected (* = marked no-connect by the designer): SD1 9(CD)*

### Notes on the sheet
- Title
- Size:
- Date:
- A4
- Number:
- Time:
- Revision:
- Sheet
- of
- File:

### Library data of the parts
C21-C23 = C_0603: as C29 on sheet XMC4800-ECAT-P0; C_value: 0.1uF; Series: X7R
LED1-LED6 LED8 LED9 LED11 LED12 = LED_0603: 0603封装发光二极管
LED7 LED10 = LED_3528: 3528封装发光二极管
P1 P2 = Header 16X2: Header, 16-Pin, Dual row; LatestRevisionDate: 17-Jul-2002; LatestRevisionNote: Re-released for DXP Platform.; Publisher: Altium Limited
P3 = Header 4X2: Header, 4-Pin, Dual row; LatestRevisionDate: 17-Jul-2002; LatestRevisionNote: Re-released for DXP Platform.; Publisher: Altium Limited
R3-R22 = R_0603: as R27 on sheet XMC4800-ECAT-P0
  R3-R9: R_value: 10K
  R10: R_value: 1M
  R11-R22: R_value: 680
S2 S3 = KEY: 轻触开关3X4X2
SD1 = Micro SD: Micro SD卡座

## Nets that join several sheets
EARTH: XMC4800-ECAT-P0 (C43.2 RJ1.8 RJ1.13 RJ1.14), XMC4800-ECAT-P1 (C61.2 RJ2.8 RJ2.13 RJ2.14)
GND: XMC4800-ECAT-P0 (24 pins), XMC4800-ECAT-P1 (20 pins), XMC4800-Core (25 pins), XMC4800-Power (16 pins), XMC4800-Misc (14 pins)
VDD3V3: XMC4800-ECAT-P0 (17 pins), XMC4800-ECAT-P1 (14 pins), XMC4800-Core (16 pins), XMC4800-Power (9 pins), XMC4800-Misc (17 pins)
BUTTON1: XMC4800-Core (U1.49), XMC4800-Misc (C21.1 R8.1 S2.1)
BUTTON2: XMC4800-Core (U1.50), XMC4800-Misc (C22.1 R9.1 S3.1)
ECAT.MDC: XMC4800-ECAT-P0 (U4.20), XMC4800-ECAT-P1 (U5.20), XMC4800-Core (U1.132)
ECAT.MDIO: XMC4800-ECAT-P0 (U4.19), XMC4800-ECAT-P1 (U5.19), XMC4800-Core (R1.1 U1.138)
ECAT.P0_LINK: XMC4800-ECAT-P0 (RJ1.10 U4.17), XMC4800-Core (U1.94)
ECAT.P0_LINK_ACT: XMC4800-ECAT-P0 (RJ1.11), XMC4800-Core (U1.98)
ECAT.P0_RXCLK: XMC4800-ECAT-P0 (R36.1), XMC4800-Core (U1.80)
ECAT.P0_RXD0: XMC4800-ECAT-P0 (RA2.1), XMC4800-Core (U1.84)
ECAT.P0_RXD1: XMC4800-ECAT-P0 (RA2.2), XMC4800-Core (U1.83)
ECAT.P0_RXD2: XMC4800-ECAT-P0 (RA2.3), XMC4800-Core (U1.82)
ECAT.P0_RXD3: XMC4800-ECAT-P0 (RA2.4), XMC4800-Core (U1.77)
ECAT.P0_RXDV: XMC4800-ECAT-P0 (U4.26), XMC4800-Core (U1.78)
ECAT.P0_RXER: XMC4800-ECAT-P0 (U4.28), XMC4800-Core (U1.76)
ECAT.P0_TXCLK: XMC4800-ECAT-P0 (R32.1), XMC4800-Core (U1.79)
ECAT.P0_TXD0: XMC4800-ECAT-P0 (RA1.1), XMC4800-Core (U1.99)
ECAT.P0_TXD1: XMC4800-ECAT-P0 (RA1.2), XMC4800-Core (U1.97)
ECAT.P0_TXD2: XMC4800-ECAT-P0 (RA1.3), XMC4800-Core (U1.96)
ECAT.P0_TXD3: XMC4800-ECAT-P0 (RA1.4), XMC4800-Core (U1.95)
ECAT.P0_TXEN: XMC4800-ECAT-P0 (U4.3), XMC4800-Core (U1.100)
ECAT.P1_LINK: XMC4800-ECAT-P1 (RJ2.10 U5.17), XMC4800-Core (U1.131)
ECAT.P1_LINK_ACT: XMC4800-ECAT-P1 (RJ2.11), XMC4800-Core (U1.9)
ECAT.P1_RXCLK: XMC4800-ECAT-P1 (R47.1), XMC4800-Core (U1.1)
ECAT.P1_RXD0: XMC4800-ECAT-P1 (RA4.1), XMC4800-Core (U1.139)
ECAT.P1_RXD1: XMC4800-ECAT-P1 (RA4.2), XMC4800-Core (U1.140)
ECAT.P1_RXD2: XMC4800-ECAT-P1 (RA4.3), XMC4800-Core (U1.141)
ECAT.P1_RXD3: XMC4800-ECAT-P1 (RA4.4), XMC4800-Core (U1.142)
ECAT.P1_RXDV: XMC4800-ECAT-P1 (U5.26), XMC4800-Core (U1.4)
ECAT.P1_RXER: XMC4800-ECAT-P1 (U5.28), XMC4800-Core (U1.30)
ECAT.P1_TXCLK: XMC4800-ECAT-P1 (R43.1), XMC4800-Core (U1.3)
ECAT.P1_TXD0: XMC4800-ECAT-P1 (RA3.1), XMC4800-Core (U1.6)
ECAT.P1_TXD1: XMC4800-ECAT-P1 (RA3.2), XMC4800-Core (U1.5)
ECAT.P1_TXD2: XMC4800-ECAT-P1 (RA3.3), XMC4800-Core (U1.144)
ECAT.P1_TXD3: XMC4800-ECAT-P1 (RA3.4), XMC4800-Core (U1.143)
ECAT.P1_TXEN: XMC4800-ECAT-P1 (U5.3), XMC4800-Core (U1.7)
ECAT.PHY_CLK: XMC4800-ECAT-P0 (U4.23), XMC4800-ECAT-P1 (U5.23), XMC4800-Core (U1.101)
ECAT.PHY_RST: XMC4800-ECAT-P0 (R27.1 U3.2), XMC4800-Core (U1.2)
ECAT_LED_1: XMC4800-Core (U1.102), XMC4800-Misc (R13.2)
ECAT_LED_2: XMC4800-Core (U1.136), XMC4800-Misc (R16.2)
ECAT_LED_3: XMC4800-Core (U1.134), XMC4800-Misc (R18.2)
ECAT_LED_4: XMC4800-Core (U1.135), XMC4800-Misc (R21.2)
ECAT_LED_5: XMC4800-Core (U1.110), XMC4800-Misc (R14.2)
ECAT_LED_6: XMC4800-Core (U1.8), XMC4800-Misc (R17.2)
ECAT_LED_7: XMC4800-Core (U1.81), XMC4800-Misc (R19.2)
ECAT_LED_8: XMC4800-Core (U1.10), XMC4800-Misc (R22.2)
ECAT_LED_ERR: XMC4800-Core (U1.128), XMC4800-Misc (R15.2)
ECAT_LED_RUN: XMC4800-Core (U1.127), XMC4800-Misc (R20.2)
ECAT_PHY_RST: XMC4800-ECAT-P0 (U3.4 U4.18), XMC4800-ECAT-P1 (U5.18)
ETH_CLK: XMC4800-Core (U1.54), XMC4800-Misc (P1.30)
ETH_CRS: XMC4800-Core (U1.53), XMC4800-Misc (P1.27)
ETH_Interrupt: XMC4800-Core (U1.109), XMC4800-Misc (P2.20)
ETH_MDC: XMC4800-Core (U1.75), XMC4800-Misc (P2.13)
ETH_MDIO: XMC4800-Core (U1.74), XMC4800-Misc (P2.14)
ETH_RXD0: XMC4800-Core (U1.72), XMC4800-Misc (P2.11)
ETH_RXD1: XMC4800-Core (U1.71), XMC4800-Misc (P2.12)
ETH_RXER: XMC4800-Core (U1.70), XMC4800-Misc (P2.9)
ETH_TXD0: XMC4800-Core (U1.68), XMC4800-Misc (P2.7)
ETH_TXD1: XMC4800-Core (U1.67), XMC4800-Misc (P2.8)
ETH_TXEN: XMC4800-Core (U1.69), XMC4800-Misc (P2.10)
HIB_IO_0: XMC4800-Core (U1.21), XMC4800-Misc (P1.5)
HIB_IO_1: XMC4800-Core (U1.20), XMC4800-Misc (P1.6)
LED1: XMC4800-Core (U1.57), XMC4800-Misc (LED1.1)
LED2: XMC4800-Core (U1.58), XMC4800-Misc (LED2.1)
MMC_CLK: XMC4800-Core (U1.129), XMC4800-Misc (SD1.5)
MMC_CMD: XMC4800-Core (U1.130), XMC4800-Misc (R5.1 SD1.3)
MMC_DAT0: XMC4800-Core (U1.124), XMC4800-Misc (R4.1 SD1.7)
MMC_DAT1: XMC4800-Core (U1.116), XMC4800-Misc (R3.1 SD1.8)
MMC_DAT2: XMC4800-Core (U1.115), XMC4800-Misc (R7.1 SD1.1)
MMC_DAT3: XMC4800-Core (U1.123), XMC4800-Misc (R6.1 SD1.2)
nRST: XMC4800-Core (C10.1 R2.1 S1.1 U1.91), XMC4800-Misc (P3.4)
P0.13: XMC4800-Core (U1.137), XMC4800-Misc (P2.29)
P1.0: XMC4800-Core (U1.112), XMC4800-Misc (P2.22)
P1.1: XMC4800-Core (U1.111), XMC4800-Misc (P2.19)
P1.8: XMC4800-Core (U1.114), XMC4800-Misc (P2.24)
P1.9: XMC4800-Core (U1.113), XMC4800-Misc (P2.21)
P1.10: XMC4800-Core (U1.106), XMC4800-Misc (P2.17)
P1.11: XMC4800-Core (U1.105), XMC4800-Misc (P2.18)
P1.12: XMC4800-Core (U1.104), XMC4800-Misc (P2.15)
P1.13: XMC4800-Core (U1.103), XMC4800-Misc (P2.16)
P2.10: XMC4800-Core (U1.66), XMC4800-Misc (P2.5)
P2.11: XMC4800-Core (U1.65), XMC4800-Misc (P2.6)
P2.12: XMC4800-Core (U1.64), XMC4800-Misc (P2.3)
P2.13: XMC4800-Core (U1.63), XMC4800-Misc (P2.4)
P2.14: XMC4800-Core (U1.60), XMC4800-Misc (P2.1)
P2.15: XMC4800-Core (U1.59), XMC4800-Misc (P2.2)
P3.7: XMC4800-Core (U1.14), XMC4800-Misc (P1.3)
P3.8: XMC4800-Core (U1.13), XMC4800-Misc (P1.4)
P3.9: XMC4800-Core (U1.12), XMC4800-Misc (P1.1)
P3.10: XMC4800-Core (U1.11), XMC4800-Misc (P1.2)
P3.15: XMC4800-Core (U1.133), XMC4800-Misc (P2.32)
P5.10: XMC4800-Core (U1.56), XMC4800-Misc (P1.32)
P5.11: XMC4800-Core (U1.55), XMC4800-Misc (P1.29)
P14.0: XMC4800-Core (U1.42), XMC4800-Misc (P1.24)
P14.1: XMC4800-Core (U1.41), XMC4800-Misc (P1.21)
P14.2: XMC4800-Core (U1.40), XMC4800-Misc (P1.22)
P14.3: XMC4800-Core (U1.39), XMC4800-Misc (P1.19)
P14.4: XMC4800-Core (U1.38), XMC4800-Misc (P1.20)
P14.5: XMC4800-Core (U1.37), XMC4800-Misc (P1.17)
P14.6: XMC4800-Core (U1.36), XMC4800-Misc (P1.18)
P14.7: XMC4800-Core (U1.35), XMC4800-Misc (P1.15)
P14.8: XMC4800-Core (U1.52), XMC4800-Misc (P1.28)
P14.9: XMC4800-Core (U1.51), XMC4800-Misc (P1.25)
P14.12: XMC4800-Core (U1.34), XMC4800-Misc (P1.16)
P14.13: XMC4800-Core (U1.33), XMC4800-Misc (P1.13)
P14.14: XMC4800-Core (U1.32), XMC4800-Misc (P1.14)
P14.15: XMC4800-Core (U1.31), XMC4800-Misc (P1.11)
P15.3: XMC4800-Core (U1.29), XMC4800-Misc (P1.12)
P15.4: XMC4800-Core (U1.28), XMC4800-Misc (P1.9)
P15.5: XMC4800-Core (U1.27), XMC4800-Misc (P1.10)
P15.6: XMC4800-Core (U1.26), XMC4800-Misc (P1.7)
P15.7: XMC4800-Core (U1.25), XMC4800-Misc (P1.8)
P15.14: XMC4800-Core (U1.44), XMC4800-Misc (P1.26)
P15.15: XMC4800-Core (U1.43), XMC4800-Misc (P1.23)
QSPI_CLK: XMC4800-Core (U1.122), XMC4800-Misc (P2.30)
QSPI_CS: XMC4800-Core (U1.121), XMC4800-Misc (P2.27)
QSPI_IO0: XMC4800-Core (U1.117), XMC4800-Misc (P2.23)
QSPI_IO1: XMC4800-Core (U1.118), XMC4800-Misc (P2.26)
QSPI_IO2: XMC4800-Core (U1.119), XMC4800-Misc (P2.25)
QSPI_IO3: XMC4800-Core (U1.120), XMC4800-Misc (P2.28)
RXD: XMC4800-Core (U1.108), XMC4800-Misc (P3.8)
SWV: XMC4800-Core (U1.73), XMC4800-Misc (P3.5)
TCK: XMC4800-Core (U1.93), XMC4800-Misc (P3.3)
TMS: XMC4800-Core (U1.92), XMC4800-Misc (P3.1)
TXD: XMC4800-Core (U1.107), XMC4800-Misc (P3.7)
USB_D_N: XMC4800-Core (U1.15), XMC4800-Power (R23.2)
USB_D_P: XMC4800-Core (U1.16), XMC4800-Power (R24.2)
VBUS: XMC4800-Core (U1.17), XMC4800-Power (D1.1 L3.2)